# EAGLE design Adapter-Board (EAGLE 7.2.0)
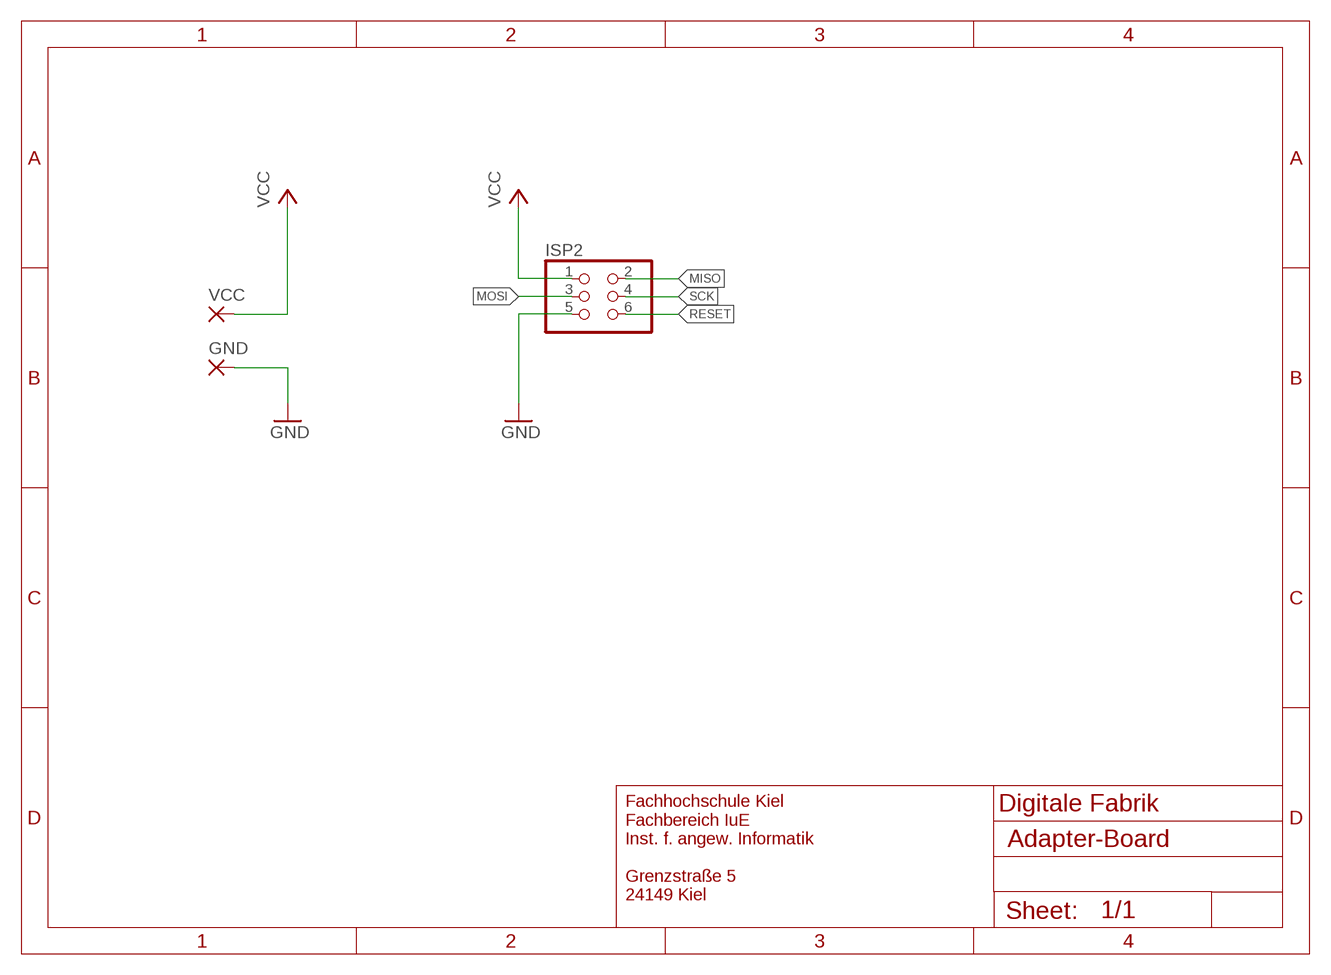
[diagram p0: schematic, sheet 1]

## Parts
GND  SMD5  [SMD2,54-5,08]
ISP2  PINHD-2X03_2.54-SMD  [2X03SMD]
VCC  SMD5  [SMD2,54-5,08]

## Nets
GND: GND.1(P) ISP2.5
MISO: ISP2.2
MOSI: ISP2.3
RESET: ISP2.6
SCK: ISP2.4
VCC: ISP2.1 VCC.1(P)

## Notes on the sheet
- Digitale Fabrik
- Fachhochschule Kiel
  Fachbereich IuE
  Inst. f. angew. Informatik
  
  Grenzstraße 5
  24149 Kiel

## Library data of the parts
GND VCC = wirepad:SMD5: SMD PAD
ISP2 = pinhead-2:PINHD-2X03: PIN HEADER

## Board
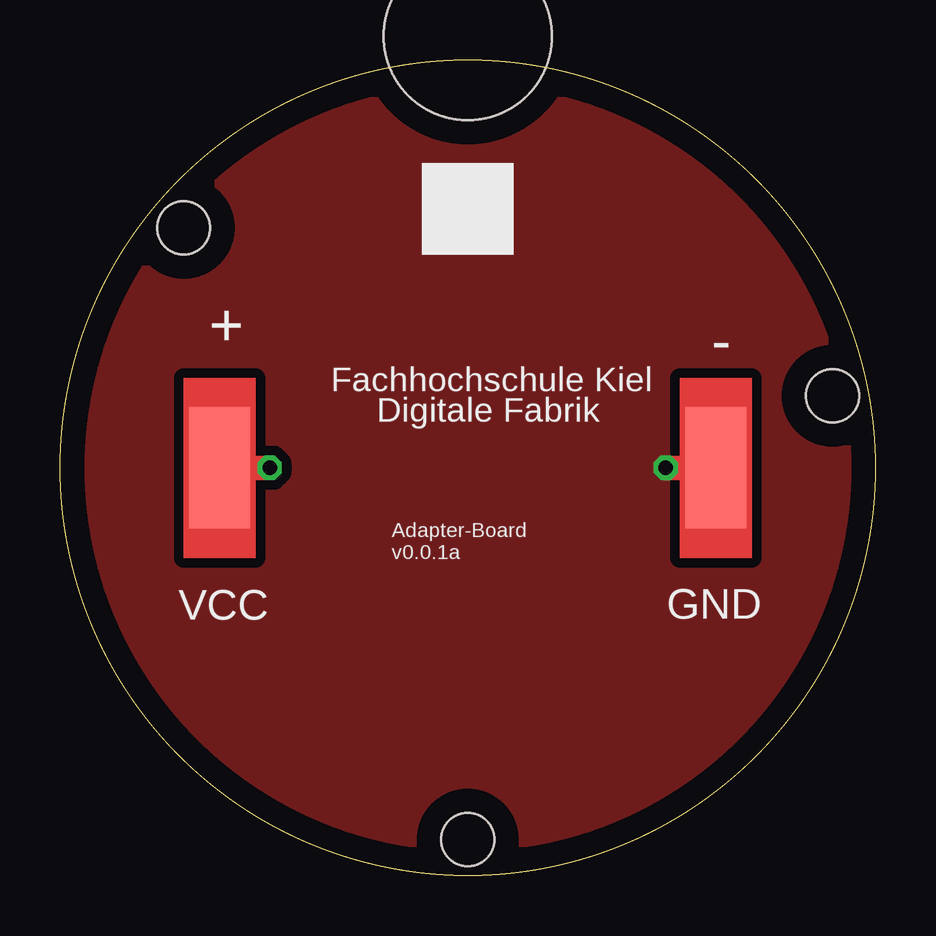
[diagram p1: board, top side]
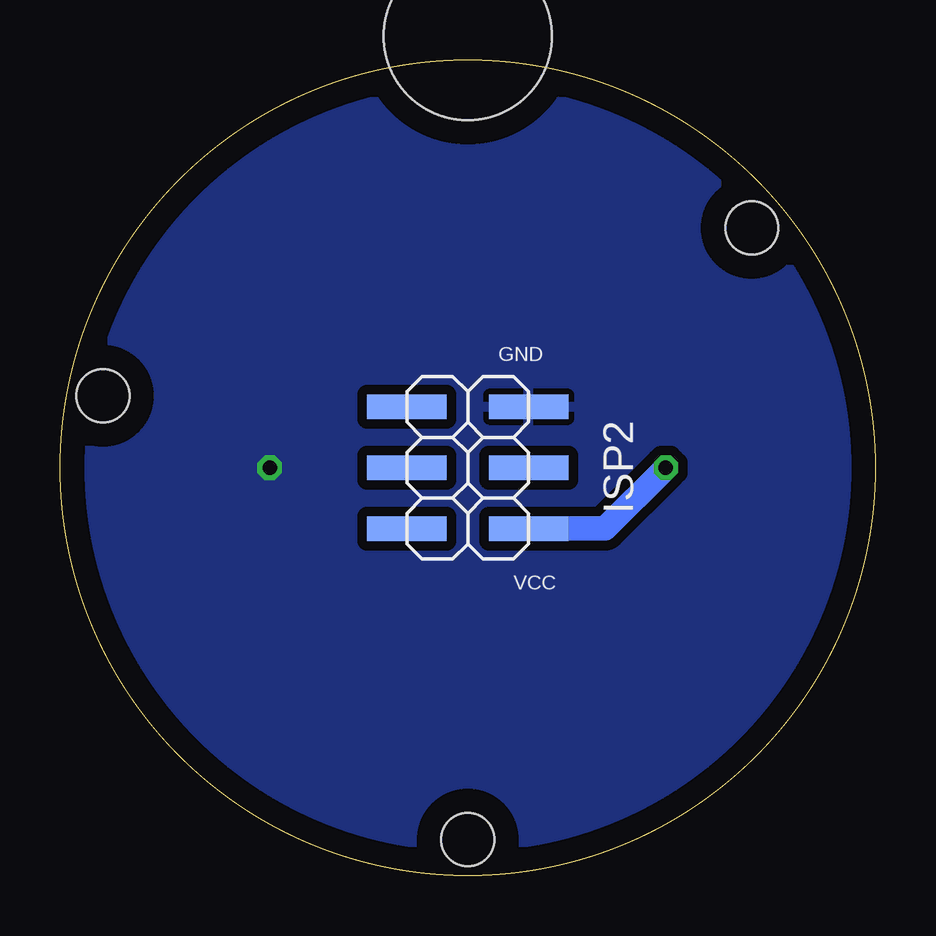
[diagram p2: board, bottom side, seen from below]

Size 34 x 34 mm. Coordinates in mm from the lower left corner, seen from the top.
Outline: circle at 17,17 radius 17
Copper layers (1*16): Top 0.035mm / dielectric 1.5mm / Bottom 0.035mm
Design rules "default": minimum track width 10mil, minimum drill 24mil, track to track 8mil, track to pad 8mil, pad to pad 8mil, via to via 8mil, smd to smd 8mil, copper to edge 40mil, drill to drill 8mil, minimum pad ring 10mil, minimum via ring 8mil, stop-mask expansion 4mil, vias tented up to drill 0mil, thermal gap 10mil
Holes 7 mm at 17,35
Holes 2.2 mm at 17,1.5 5.16,27 32.21,20

### Footprints (pad centres in the part's own frame; a part is rotated, then mirrored left to right if it is on the bottom)
SMD2,54-5,08 = smd 2.54 x 5.08: 1 0,0
2X03SMD = smd 1.016 x 3.302: 1 -1.27,-3.81; 2 -1.27,1.27; 3 1.27,-3.81; 4 1.27,1.27; 5 3.81,-3.81; 6 3.81,1.27

### Placement (x,y rotation side)
GND  27.35,17 0 top
ISP2  18.27,15.73 90 bottom
VCC  6.65,17 0 top

### Tracks (layer width: path | path; a pad name or v marks a point on that pad's centre or on a via)
GND  (via drill 0.6)
  Top 1.016: GND.1 v25.26,17
  pour Top (isolate 0.406): -0.14,-0.14 -0.14,34.14 34.14,34.14 34.14,-0.14
  pour Bottom (isolate 0.406): -0.14,-0.14 -0.14,34.14 34.14,34.14 34.14,-0.14
VCC  (via drill 0.6)
  Top 1.016: v8.74,17 VCC.1
  Bottom 1.016: ISP2.1 11.29,14.46 v8.74,17
(copper drawn outside any net)
  shapes: Top area x2

### Text on the board
tNames: + | - | Fachhochschule Kiel | Digitale Fabrik | Adapter-Board / v0.0.1a
bNames: GND | VCC